# EAGLE schematic Tilty Template (EAGLE 6.5.0)
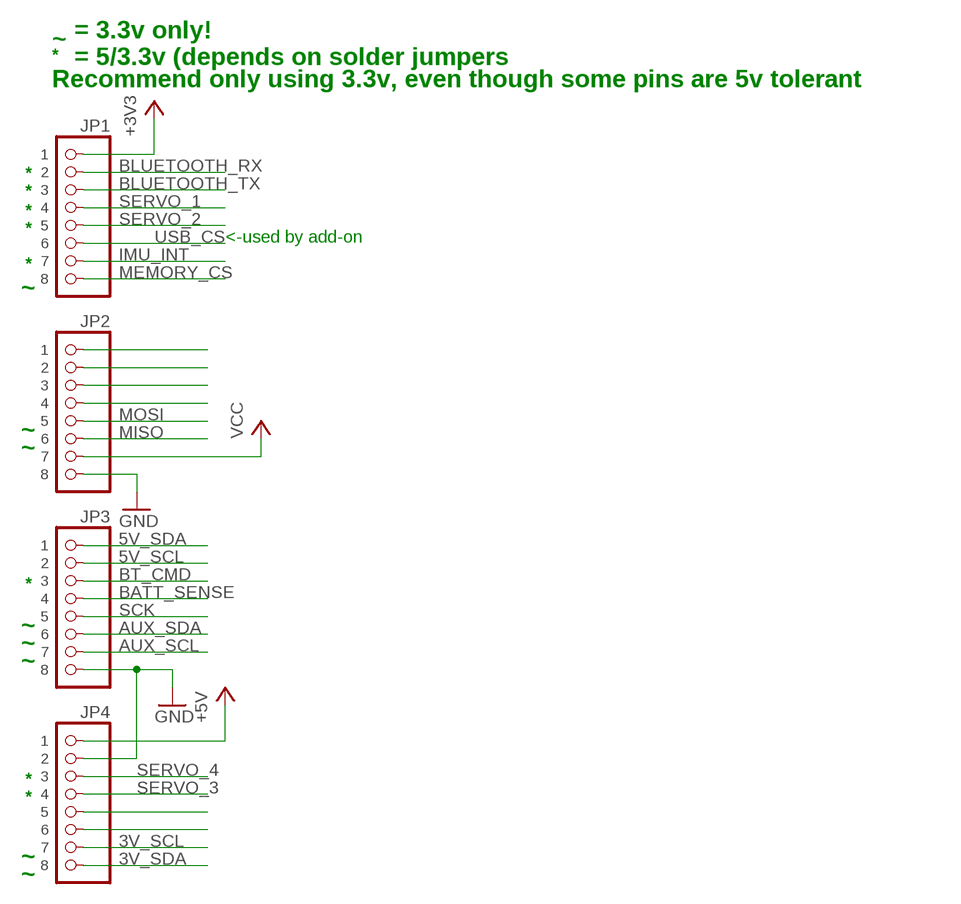
[diagram p0: schematic, sheet 1]

## Parts
JP1  8-PIN_HEADER  [8-PIN_RECEPTACLE_LOCK_NO-SS]
JP2  8-PIN_HEADER  [8-PIN_RECEPTACLE_LOCK_NO-SS]
JP3  8-PIN_HEADER  [8-PIN_RECEPTACLE_LOCK_NO-SS]
JP4  8-PIN_HEADER  [8-PIN_RECEPTACLE_LOCK_NO-SS]

## Nets
3V_SCL: JP4.P$7
3V_SDA: JP4.P$8
5V_SCL: JP3.P$2
5V_SDA: JP3.P$1
+3V3: JP1.P$1
+5V: JP4.P$1
AUX_SCL: JP3.P$7
AUX_SDA: JP3.P$6
BATT_SENSE: JP3.P$4
BLUETOOTH_RX: JP1.P$2
BLUETOOTH_TX: JP1.P$3
BT_CMD: JP3.P$3
GND: JP2.P$8 JP3.P$8 JP4.P$2
IMU_INT: JP1.P$7
MEMORY_CS: JP1.P$8
MISO: JP2.P$6
MOSI: JP2.P$5
N$4: JP2.P$4
N$5: JP2.P$3
N$6: JP2.P$2
N$7: JP2.P$1
N$26: JP4.P$5
N$27: JP4.P$6
SCK: JP3.P$5
SERVO_1: JP1.P$4
SERVO_2: JP1.P$5
SERVO_3: JP4.P$4
SERVO_4: JP4.P$3
USB_CS: JP1.P$6
VCC: JP2.P$7

## Notes on the sheet
- = 3.3v only!
- ~
- * | = 5/3.3v (depends on solder jumpers
- Recommend only using 3.3v, even though some pins are 5v tolerant
- *
- *
- *
- *
- <-used by add-on
- *
- ~
- ~
- ~
- *
- ~
- ~
- ~
- *
- *
- ~
- ~

## Library data of the parts
JP1-JP4 = My Parts:8-PIN_HEADER